# EAGLE design BaseModule_v8 (EAGLE 9.6.2)
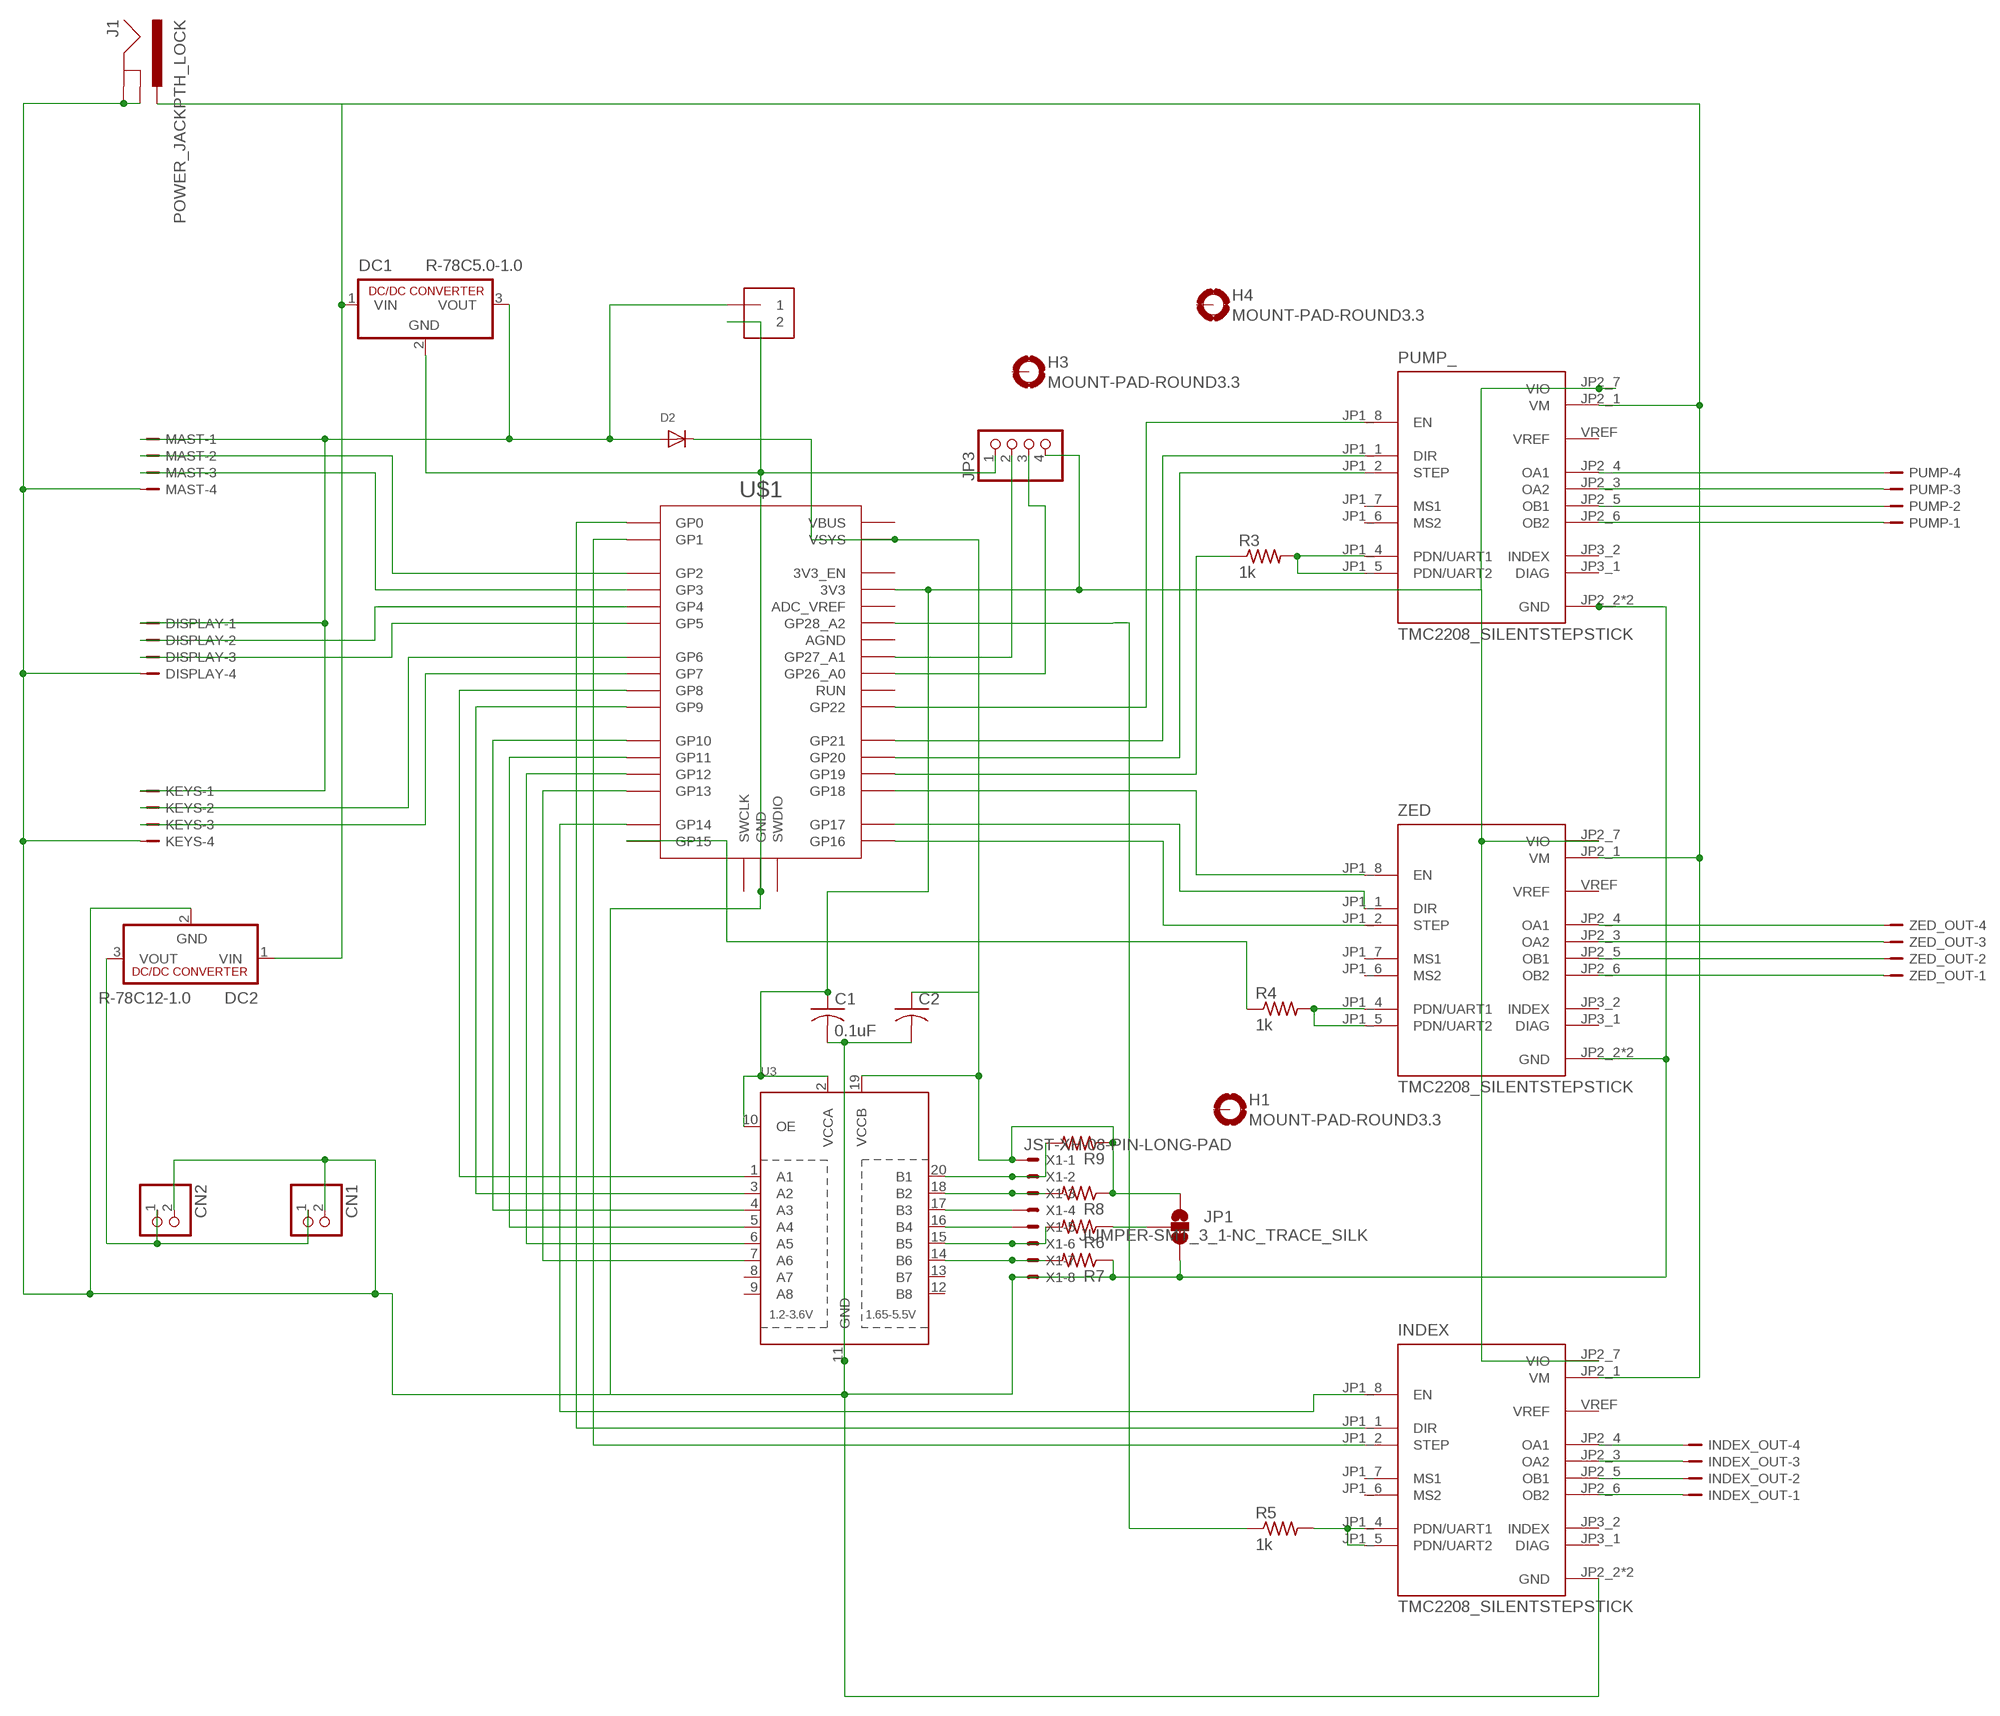
[diagram p0: schematic, sheet 1]

## Parts
C1  0.1uF  C-USC1206  [C1206]
C2  C-USC1206  [C1206]
CN1  JST_2PIN-THM-RA  [JST-PH-2-THM-RA]
CN2  JST_2PIN-THM-RA  [JST-PH-2-THM-RA]
D2  DIODESMA  [SMADIODE]
DC1  R-78C5.0-1.0  [SIP3]
DC2  R-78C12-1.0  [SIP3]
DISPLAY  JST-PH-4_TH-V  [B4B-PH-K-S]
H1  MOUNT-PAD-ROUND3.3  [3,3-PAD]
H3  MOUNT-PAD-ROUND3.3  [3,3-PAD]
H4  MOUNT-PAD-ROUND3.3  [3,3-PAD]
INDEX  TMC2208_SILENTSTEPSTICK  [MODULE_TMC2208_SILENTSTEPSTICK]
INDEX_OUT  JST-PH-4_TH-RA  [S4B-PH-KL]
J1  POWER_JACKPTH_LOCK  [POWER_JACK_PTH_LOCK]
J2  1X2-3.5MM  [1X2-3.5MM]
JP1  JUMPER-SMT_3_1-NC_TRACE_SILK  [SMT-JUMPER_3_1-NC_TRACE_SILK]
JP3  PINHD-1X4  [1X04]
KEYS  JST-PH-4_TH-V  [B4B-PH-K-S]
MAST  JST-PH-4_TH-V  [B4B-PH-K-S]
PUMP  JST-PH-4_TH-RA  [S4B-PH-KL]
PUMP_  TMC2208_SILENTSTEPSTICK  [MODULE_TMC2208_SILENTSTEPSTICK]
R3  1k  R-US_R1206  [R1206]
R4  1k  R-US_R1206  [R1206]
R5  1k  R-US_R1206  [R1206]
R6  R-US_M1206  [M1206]
R7  R-US_M1206  [M1206]
R8  R-US_M1206  [M1206]
R9  R-US_M1206  [M1206]
U3  TXB0108PWR  [TSSOP20]
U$1  RPI_PICO-TH  [RPI_PICO_TH]
X1  JST-XH-08-PIN-LONG-PAD  [JST-XH-08-PACKAGE-LONG-PAD]
ZED  TMC2208_SILENTSTEPSTICK  [MODULE_TMC2208_SILENTSTEPSTICK]
ZED_OUT  JST-PH-4_TH-RA  [S4B-PH-KL]

## Nets
5V: C2.1 D2.C JP1.1 R8.1 R9.1 U3.19(VCCB) U$1.VSYS X1.1
GND: C1.2 C2.2 CN1.2 CN2.2 DC1.2(GND) DC2.2(GND) DISPLAY.4 INDEX.JP2_2(GND) INDEX.JP2_8(GND) J1.GND J1.GNDBREAK J2.2 JP1.3 JP3.1 KEYS.4 MAST.4 PUMP_.JP2_2(GND) PUMP_.JP2_8(GND) R7.1 U3.11(GND) U$1.GND@1(GND) U$1.GND@2(GND) U$1.GND@3(GND) U$1.GND@4(GND) U$1.GND@5(GND) U$1.GND@6(GND) U$1.GND@7(GND) U$1.GND@8(GND) X1.8 ZED.JP2_2(GND) ZED.JP2_8(GND)
KEYS: KEYS.2 U$1.GP6
N$1: JP3.2 U$1.GP27_A1
N$2: JP3.3 U$1.GP26_A0
N$3: PUMP_.JP1_4(PDN/UART1) PUMP_.JP1_5(PDN/UART2) R3.2
N$4: R4.2 ZED.JP1_4(PDN/UART1) ZED.JP1_5(PDN/UART2)
N$5: DC1.1(VIN) DC2.1(VIN) INDEX.JP2_1(VM) J1.PWR PUMP_.JP2_1(VM) ZED.JP2_1(VM)
N$6: U$1.GP18 ZED.JP1_8(EN)
N$7: INDEX.JP2_4(OA1) INDEX_OUT.4
N$9: U3.7(A6) U$1.GP13
N$11: R9.2 U3.20(B1) X1.2
N$12: R4.1 U$1.GP15
N$13: D2.A DC1.3(VOUT) DISPLAY.1 J2.1 KEYS.1 MAST.1
N$14: INDEX.JP2_3(OA2) INDEX_OUT.3
N$15: ZED.JP2_4(OA1) ZED_OUT.4
N$16: ZED.JP2_3(OA2) ZED_OUT.3
N$17: ZED.JP2_5(OB1) ZED_OUT.2
N$18: ZED.JP2_6(OB2) ZED_OUT.1
N$19: PUMP.4 PUMP_.JP2_4(OA1)
N$20: PUMP.3 PUMP_.JP2_3(OA2)
N$21: PUMP.2 PUMP_.JP2_5(OB1)
N$22: PUMP.1 PUMP_.JP2_6(OB2)
N$23: U$1.GP17 ZED.JP1_1(DIR)
N$24: U$1.GP16 ZED.JP1_2(STEP)
N$25: R8.2 U3.18(B2) X1.3
N$26: PUMP_.JP1_8(EN) U$1.GP22
N$27: PUMP_.JP1_1(DIR) U$1.GP21
N$28: PUMP_.JP1_2(STEP) U$1.GP20
N$29: R3.1 U$1.GP19
N$30: MAST.2 U$1.GP2
N$31: MAST.3 U$1.GP3
N$32: DISPLAY.2 U$1.GP4
N$33: DISPLAY.3 U$1.GP5
N$35: KEYS.3 U$1.GP7
N$37: U3.17(B3) X1.4
N$38: U3.16(B4) X1.5
N$39: R6.2 U3.15(B5) X1.6
N$40: R7.2 U3.14(B6) X1.7
N$41: U3.1(A1) U$1.GP8
N$42: INDEX.JP2_5(OB1) INDEX_OUT.2
N$43: C1.1 INDEX.JP2_7(VIO) JP3.4 PUMP_.JP2_7(VIO) U3.2(VCCA) U3.10(OE) U$1.3V3 ZED.JP2_7(VIO)
N$46: U3.3(A2) U$1.GP9
N$47: U3.4(A3) U$1.GP10
N$48: U3.5(A4) U$1.GP11
N$49: U3.6(A5) U$1.GP12
N$50: CN1.1 CN2.1 DC2.3(VOUT)
N$53: INDEX.JP2_6(OB2) INDEX_OUT.1
N$54: INDEX.JP1_8(EN) U$1.GP14
N$55: R5.1 U$1.GP28_A2
N$56: INDEX.JP1_4(PDN/UART1) INDEX.JP1_5(PDN/UART2) R5.2
N$57: INDEX.JP1_1(DIR) U$1.GP0
N$58: INDEX.JP1_2(STEP) U$1.GP1
N$61: JP1.2 R6.1
Unconnected: H1.B3,3(MOUNT) H3.B3,3(MOUNT) H4.B3,3(MOUNT) INDEX.JP1_6(MS2) INDEX.JP1_7(MS1) INDEX.JP3_1(DIAG) INDEX.JP3_2(INDEX) INDEX.VREF PUMP_.JP1_6(MS2) PUMP_.JP1_7(MS1) PUMP_.JP3_1(DIAG) PUMP_.JP3_2(INDEX) PUMP_.VREF U3.8(A7) U3.9(A8) U3.12(B8) U3.13(B7) U$1.3V3_EN U$1.ADC_VREF U$1.AGND U$1.RUN U$1.SWCLK U$1.SWDIO U$1.VBUS ZED.JP1_6(MS2) ZED.JP1_7(MS1) ZED.JP3_1(DIAG) ZED.JP3_2(INDEX) ZED.VREF

## Library data of the parts
C1 C2 = adafruit:C-US: CAPACITOR, American symbol
CN1 CN2 = adafruit:JST_2PIN: JST 2-Pin Connectors of various flavors SMT-RA (S2B-PH-SM4) 4UConnector #17311 SMT (B2B-PH-SM4) THM-RA (S2B-PH) THM (B2B-PH)
D2 = adafruit:DIODE: Diode SMADIODE - SMA Surface Mount Package 20V 1A Schottky Diode Digikey: 641-1014-6-ND DO-1N4148 - Through Hole Small Current Diode SOD-123 20V 1 A (.5mV Vf) Schottky Diode - Digikey: MBRX120TPMSCT-ND SOD-323 10V 570mA (.38mV Vf, 3ns) Schottky Diode - Digikey: ZLLS410CT-ND SOD-523 30V 30mA Schottky Diode (RB751S-40TE61) - Digikey: RB751S-40TE61CT-ND SOT23-R/W - SOT23 Package (R = Solder Paste/Reflow Ovens, W = Hand-Soldering) BAT54Film 40V 300mA - Digikey: 497-7162-1-ND
DC1 DC2 = dc-dc-converter:R-78C*-1.0: INNOLINE DC/DC-Converter 1.0 AMP SIP3 Single Output Source: Data sheet <http://www.mikrocontroller.net/attachment/150645/157764-da-01-en-DC_DC_WANDLER_R_78C5_0_1_0.pdf>
DISPLAY KEYS MAST = con-JST-PH:JST-PH-4; MF: JST; MPN: B4B-PH-K-S
H1 H3 H4 = holes:MOUNT-PAD-ROUND: MOUNTING PAD, round
INDEX PUMP_ ZED = TMC2208_SILENTSTEPSTICK:TMC2208_SILENTSTEPSTICK: Check availability <https://pricing.snapeda.com/parts/TMC2208%20SILENTSTEPSTICK/Trinamic%20Motion/view-part?ref=eda>; AVAILABILITY: In Stock; CHECK_PRICES: https://www.snapeda.com/parts/TMC2208%20SILENTSTEPSTICK/Trinamic/view-part/?ref=eda; DESCRIPTION: TMC2208 Motor Controller/Driver, Stepper Power Management Evaluation Board; MF: Trinamic Motion; MP: TMC2208 SILENTSTEPSTICK; PACKAGE: None; PRICE: None; SNAPEDA_LINK: https://www.snapeda.com/parts/TMC2208%20SILENTSTEPSTICK/Trinamic/view-part/?ref=snap
INDEX_OUT PUMP ZED_OUT = con-JST-PH:JST-PH-4; MF: JST; MPN: S4B-PH-KL
J1 = SparkFun-Connectors:POWER_JACK: Power Jack Connector This is the standard 5.5mm barrel jack for power. The PTH is the most common, proven, reliable, footprint. The Slot footprint only works if the mill layer is transmitted to the PCB fab house so be warned. Here are the connectors we sell at SparkFun: DC Barrel Power Jack/Connector <https://www.sparkfun.com/products/119> (PRT-00119) DC Barrel Power Jack/Connector (SMD) <https://www.sparkfun.com/products/12748> (PRT-12748) DC Barrel Jack Adapter - Breadboard Compatible <https://www.sparkfun.com/products/10811> (PRT-10811) It is used on this SparkFun product (and many, many others): SparkFun RedBoard - Programmed with Arduino <https://www.sparkfun.com/products/12757> (DEV-12757) Also, if you need a mating power supply or connector, please check these out: Wall Adapter Power Supply - 9VDC 650mA <https://www.sparkfun.com/products/298> (TOL-00298) DC Barrel Jack Adapter - Male <https://www.sparkfun.com/products/10287> (PRT-10287); PROD_ID: CONN-08197; SF_ID: PRT-00119
J2 = adafruit:1X2: 3.5mm Terminal block http://www.ladyada.net/library/pcb/eaglelibrary.html
JP1 = SparkFun-Jumpers:JUMPER-SMT_3_1-NC_TRACE: Normally closed trace jumper (1 of 2 connections) This jumper has a trace between two pads so it's normally closed (NC). The other connection is normally open (NO). Use a razor knife to open the connection. For best results follow the IPC guidelines for cutting traces: Cutout at least 0.063 mm (0.005 in). Remove all loose material to clean up the cut area. Seal the cut with an approved epoxy. Reapply solder to reclose the connection, or to close the NO connection.
JP3 = pinhead:PINHD-1X4: PIN HEADER
R3-R9 = adafruit:R-US_: RESISTOR, American symbol
U3 = adafruit:TXB0108PWR: 8-Bit Bi-Directional Level Shifter 1.2V-3.6V (VCCA) to 1.65V-5.5V (VCCB) bi-directional level shifter with auto direction sensing. Max data rate - VCCA 1.8V: 20Mbps (50ns), VCCA 3.3V: 100Mbps (10ns) Digikey: 296-21527-1-ND
U$1 = RaspberryPi_Pico:RPI_PICO
X1 = Rembrandt Electronics - JST XH Connectors v1-0:JST-XH-08-PIN: JST XH Connector 2 Pin Wire to board connector. Pitch: 2,54 mm, (0.100") Number of pins: 8 Created by Rembrandt Electronics www.rembrandtelectronics.com

## Board
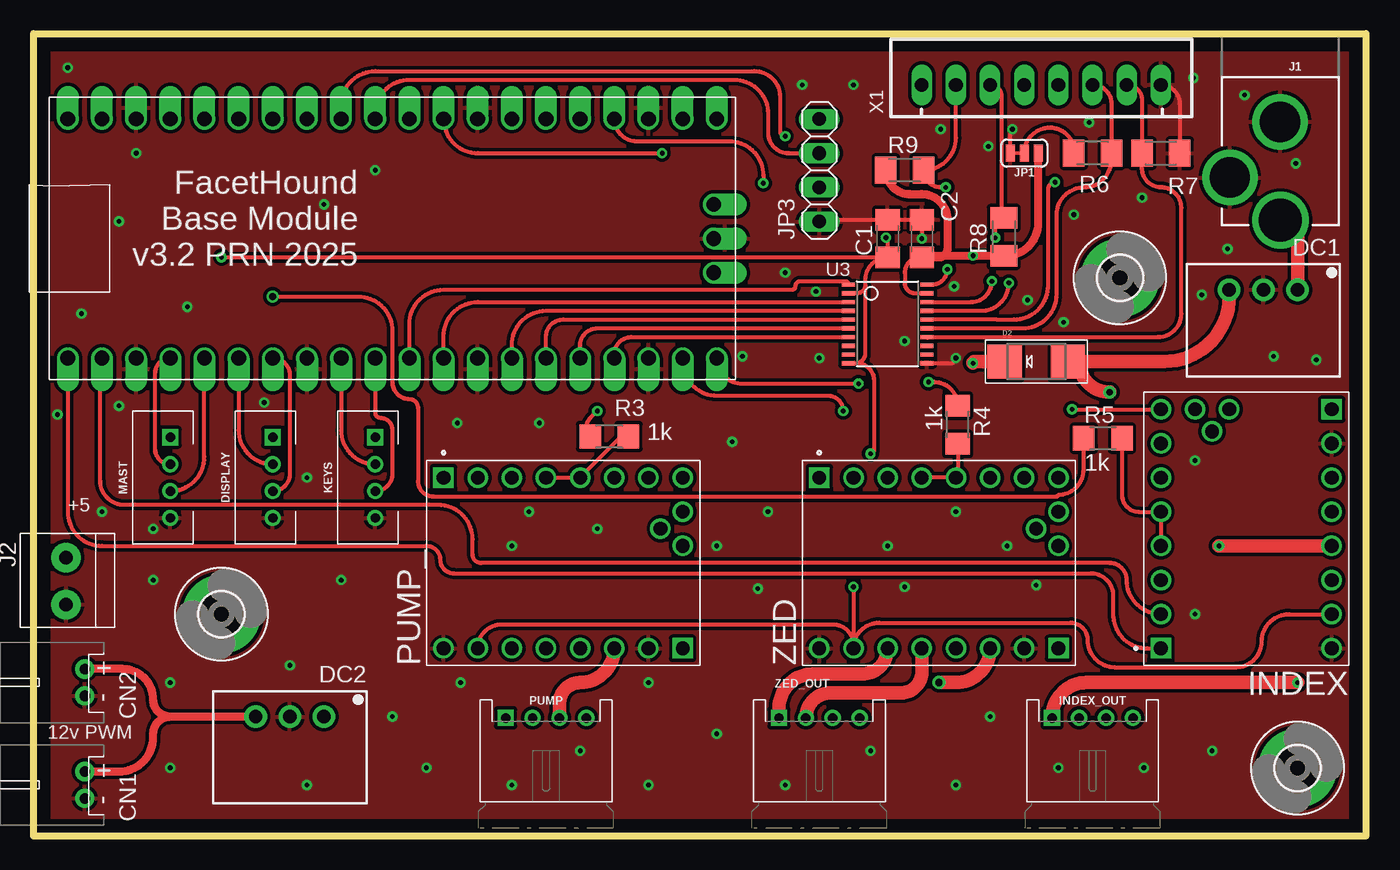
[diagram p1: board, top side]
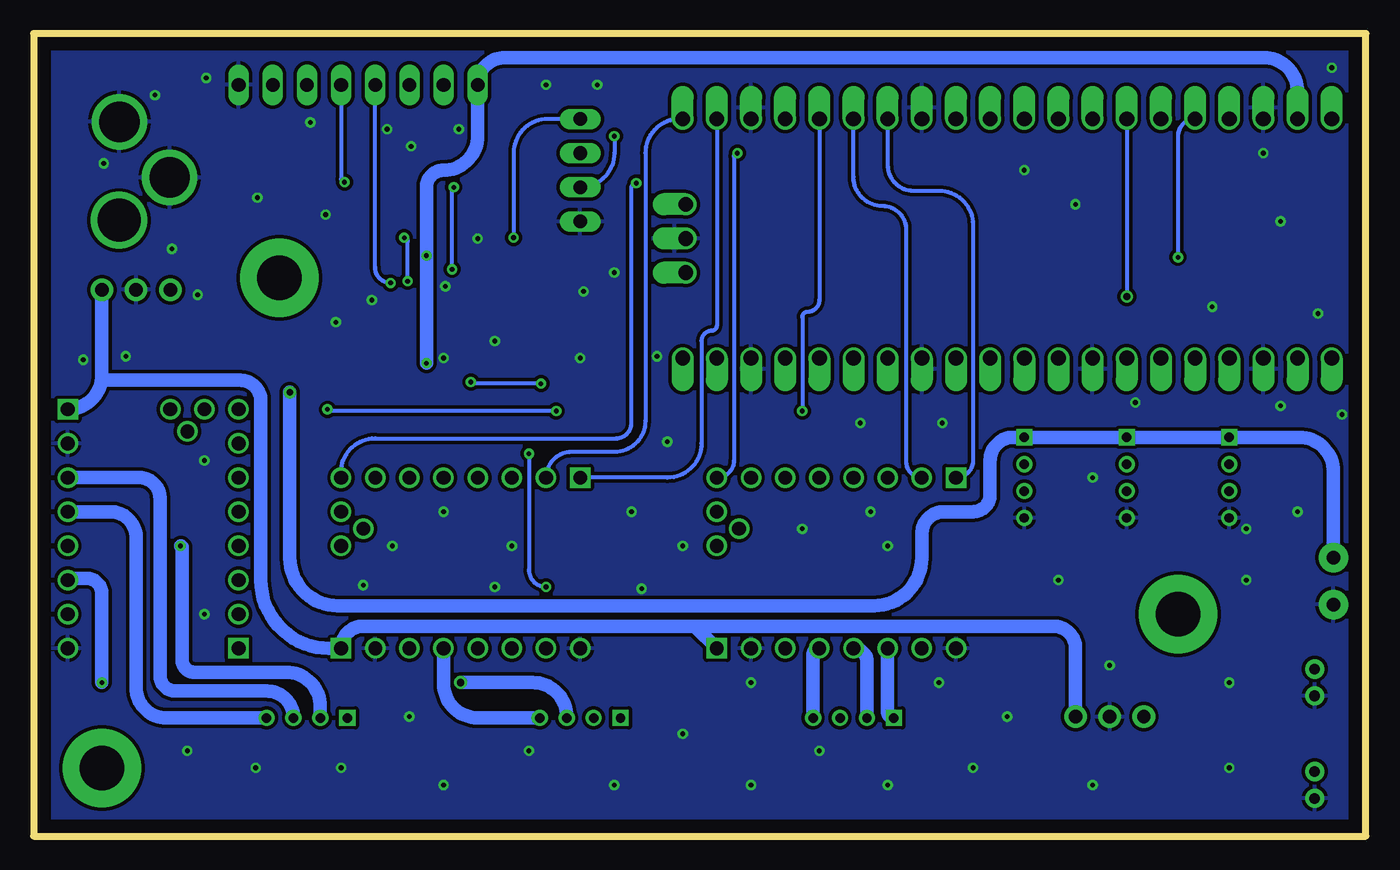
[diagram p2: board, bottom side, seen from below]

Size 99.06 x 59.69 mm. Coordinates in mm from the lower left corner, seen from the top.
Outline: 0,0 0,59.69 99.06,59.69 99.06,0 0,0
Copper layers (1*16): Top 0.035mm / dielectric 1.5mm / Bottom 0.035mm
Design rules "default": minimum track width 6mil, minimum drill 0.35mm, track to track 6mil, track to pad 6mil, pad to pad 6mil, via to via 6mil, smd to smd 6mil, copper to edge 40mil, drill to drill 6mil, minimum pad ring 10mil, minimum via ring 8mil, stop-mask expansion 4mil, vias tented up to drill 0mil, thermal gap 10mil

### Footprints (pad centres in the part's own frame; a part is rotated, then mirrored left to right if it is on the bottom)
C1206 = smd 1.6 x 1.8: 1 -1.4,0; 2 1.4,0
JST-PH-2-THM-RA = drill 0.8 pad 1.422: 1 1,0; 2 -1,0
SMADIODE = smd 2.54 x 2.54: A 2.349,0; C -2.349,0
SIP3 = drill 1 pad 1.676: 1 -2.54,0; 2 0,0; 3 2.54,0
B4B-PH-K-S = drill 0.7 square: 1 3,0 | drill 0.7: 2 1,0; 3 -1,0; 4 -3,0
3,3-PAD = drill 3.3 pad 5.842: B3,3 0,0
MODULE_TMC2208_SILENTSTEPSTICK = drill 1.016 square: JP1_1 6.35,8.89; JP2_1 -6.35,-8.89 | drill 1.016: JP1_2 6.35,6.35; JP1_3 6.35,3.81; JP1_4 6.35,1.27; JP1_5 6.35,-1.27; JP1_6 6.35,-3.81; JP1_7 6.35,-6.35; JP1_8 6.35,-8.89; JP2_2 -6.35,-6.35; JP2_3 -6.35,-3.81; JP2_4 -6.35,-1.27; JP2_5 -6.35,1.27; JP2_6 -6.35,3.81; JP2_7 -6.35,6.35; JP2_8 -6.35,8.89; JP3_1 1.27,-8.89; JP3_2 3.81,-8.89; VREF 2.54,-7.239
S4B-PH-KL = drill 0.7 square: 1 3,-3.72 | drill 0.7: 2 1,-3.72; 3 -1,-3.72; 4 -3,-3.72
POWER_JACK_PTH_LOCK = drill 2.997 pad 4.115: GND 0.025,6.557; GNDBREAK 3.762,10.7 | drill 3.2 pad 4.115: PWR 0,13.878
1X2-3.5MM = drill 1 pad 2.184: 1 1.8,0; 2 -1.7,0
SMT-JUMPER_3_1-NC_TRACE_SILK = smd 0.66 x 1.27: 1 -1.041,0; 2 0,0; 3 1.041,0
1X04 = drill 1.016 long: 1 -3.81,0; 2 -1.27,0; 3 1.27,0; 4 3.81,0
R1206 = smd 1.6 x 1.803: 1 -1.422,0; 2 1.422,0
M1206 = smd 1.6 x 2: 1 -1.4,0; 2 1.4,0
TSSOP20 = smd 0.305 x 0.991: 1 -2.925,-2.918; 2 -2.275,-2.918; 3 -1.625,-2.918; 4 -0.975,-2.918; 5 -0.325,-2.918; 6 0.325,-2.918; 7 0.975,-2.918; 8 1.625,-2.918; 9 2.275,-2.918; 10 2.925,-2.918; 11 2.925,2.918; 12 2.275,2.918; 13 1.625,2.918; 14 0.975,2.918; 15 0.325,2.918; 16 -0.325,2.918; 17 -0.975,2.918; 18 -1.625,2.918; 19 -2.275,2.918; 20 -2.925,2.918
RPI_PICO_TH = drill 1.1 pad 1.6 offset: 3V3 8.89,13.97; 3V3_EN 8.89,16.51; ADC_VREF 8.89,11.43; AGND 8.89,6.35; GND@1 -8.89,19.05; GND@2 -8.89,6.35; GND@3 -8.89,-6.35; GND@4 -8.89,-19.05; GND@5 0,-23.9; GND@6 8.89,-19.05; GND@7 8.89,-6.35; GND@8 8.89,19.05; GP0 -8.89,24.13; GP1 -8.89,21.59; GP2 -8.89,16.51; GP3 -8.89,13.97; GP4 -8.89,11.43; GP5 -8.89,8.89; GP6 -8.89,3.81; GP7 -8.89,1.27; GP8 -8.89,-1.27; GP9 -8.89,-3.81; GP10 -8.89,-8.89; GP11 -8.89,-11.43; GP12 -8.89,-13.97; GP13 -8.89,-16.51; GP14 -8.89,-21.59; GP15 -8.89,-24.13; GP16 8.89,-24.13; GP17 8.89,-21.59; GP18 8.89,-16.51; GP19 8.89,-13.97; GP20 8.89,-11.43; GP21 8.89,-8.89; GP22 8.89,-3.81; GP26_A0 8.89,1.27; GP27_A1 8.89,3.81; GP28_A2 8.89,8.89; RUN 8.89,-1.27; SWCLK -2.54,-23.9; SWDIO 2.54,-23.9; VBUS 8.89,24.13; VSYS 8.89,21.59
JST-XH-08-PACKAGE-LONG-PAD = drill 1.016 long: 1 -8.89,0; 2 -6.35,0; 3 -3.81,0; 4 -1.27,0; 5 1.27,0; 6 3.81,0; 7 6.35,0; 8 8.89,0

### Placement (x,y rotation side)
C1  63.5,44.45 90 top
C2  66.04,44.45 90 top
CN1  3.81,3.81 90 top
CN2  3.81,11.43 90 top
D2  74.55,35.31 0 top
DC1  91.44,40.64 180 top
DC2  19.05,8.89 180 top
DISPLAY  17.78,26.67 90 top
H1  80.77,41.53 0 top
H3  93.98,5.08 0 top
H4  13.97,16.51 0 top
INDEX  90.17,22.86 180 top
INDEX_OUT  78.74,5.08 180 top
J1  92.71,59.69 180 top
J2  2.41,18.92 90 top
JP1  73.66,50.8 180 top
JP3  58.42,49.53 90 top
KEYS  25.4,26.67 90 top
MAST  10.16,26.67 90 top
PUMP  38.1,5.08 180 top
PUMP_  39.37,20.32 90 top
R3  42.8,29.72 0 top
R4  68.71,30.61 270 top
R5  79.5,29.59 0 top
R6  78.74,50.8 0 top
R7  83.82,50.8 180 top
R8  72.14,44.58 90 top
R9  64.77,49.53 0 top
U3  63.5,38.1 270 top
U$1  26.67,44.45 90 top
X1  74.93,55.88 0 top
ZED  67.31,20.32 90 top
ZED_OUT  58.42,5.08 180 top

### Tracks (layer width: path | path; a pad name or v marks a point on that pad's centre or on a via)
5V  (via drill 0.35)
  Top 0.305: R8.1 72.14,43.31 | C2.1 65.91,43.05 arc90 64.77,41.91 64.77,41.15 arc90 65.53,40.39 66.41,40.39 arc-90 U3.19
  Top 0.61: R9.1 arc90 65.15,47.75 66.04,47.75 arc-90 67.94,45.85 67.94,43.69 arc-90 67.31,43.05 C2.1 arc-90 66.17,43.18 v69.85,43.18 R8.1 arc-90 R8.1 72.29,43.18 arc90 74.7,45.59 JP1.1
  Top 1.016: v69.85,35.18 arc-90 69.98,35.31 D2.C
  Bottom 1.016: v69.85,35.18 v69.85,43.18 69.85,48.26 arc90 68.58,49.53 arc-90 66.04,52.07 X1.1 arc90 64.01,57.91 7.62,57.91 arc90 5.08,55.37 U$1.VSYS 5.08,54.61
GND  (via drill 0.35)
  Top 0.305: U3.11 68.19,35.17 arc90 v68.58,35.56 | JP3.1 arc-90 58.55,45.85 C1.2 C2.2 v66.04,44.45 | X1.8 arc-90 85.22,54.48 R7.1 | JP1.3 72.62,52.43 arc-90 v72.77,52.58
  other vias: 8.89,19.05 10.16,11.43 10.16,5.08 19.05,12.7 22.86,19.05 26.67,8.89 29.21,5.08 31.75,11.43 20.32,3.81 45.72,3.81 40.64,6.35 35.56,3.81 45.72,11.43 50.8,7.62 55.88,3.81 62.23,6.35 68.58,3.81 71.12,8.89 76.2,5.08 82.55,5.08 87.63,6.35 86.36,16.51 86.36,27.94 72.39,21.59 68.58,24.13 63.5,21.59 54.61,24.13 50.8,21.59 41.91,22.86 36.83,24.13 35.56,21.59 20.32,26.67 8.89,22.86 5.08,24.13 11.43,39.37 6.35,45.72 25.4,49.53 21.59,46.99 7.62,50.8 2.54,57.15 57.15,55.88 60.96,55.88 64.77,36.83 58.42,35.56 55.88,41.91 52.7,35.69 77.34,46.23 82.42,47.5 88.77,43.69 93.85,50.04 90.04,55.12 86.23,56.39 70.99,51.31 67.44,52.58 78.49,53.09 76.58,38.23 73.91,39.88 68.45,40.89 51.94,29.34 37.59,30.73 31.5,30.73 92.2,35.69 95.38,35.43 86.87,40.26 64.77,18.54 74.55,18.67 53.85,18.41 1.78,31.37 6.35,32 17.14,32.26 3.56,38.86 58.17,40.51
  pour Bottom (isolate 0.254): 0,59.69 0,1.27 99.06,1.27 99.06,59.69
  pour Top (isolate 0.254): 0,0 99.06,0 99.06,58.42 0,58.42
KEYS
  Top 0.305: U$1.GP6 22.86,30.21 arc90 KEYS.2
N$1  (via drill 0.35)
  Top 0.305: U$1.GP27_A1 22.86,54.36 arc-90 25.4,56.9 53.59,56.9 arc-90 55.5,54.99 55.5,52.45 arc90 v55.88,52.07
  Bottom 0.305: v55.88,52.07 55.88,50.8 arc90 JP3.2
N$2
  Top 0.305: U$1.GP26_A0 25.4,53.72 arc-90 27.94,56.26 52.07,56.26 arc-90 54.61,53.72 54.61,52.32 arc90 56.13,50.8 JP3.3
N$3
  Top 0.305: R3.2 43.69,29.72 PUMP_.JP1_5 PUMP_.JP1_4
N$4
  Top 0.305: 68.58,29.87 arc90 68.71,29.74 R4.2 68.71,26.8 arc-90 ZED.JP1_5 ZED.JP1_4
N$5
  Top 1.016: DC1.1 93.98,44.54 arc90 J1.PWR 93.34,45.81
  Bottom 1.016: DC1.1 93.98,34.29 | 93.98,34.29 93.98,33.91 83.69,33.91 arc90 82.17,32.38 82.17,19.05 arc-90 77.09,13.97 ZED.JP2_1 arc90 74.55,15.62 49.91,15.62 | PUMP_.JP2_1 49.91,15.62 | 93.98,34.29 arc90 INDEX.JP2_1 | 49.91,15.62 23.24,15.62 arc90 21.59,13.97 DC2.1
N$6  (via drill 0.35)
  Top 0.305: 43.05,53.47 arc90 U$1.GP18 arc90 44.83,51.69 51.71,51.69 arc-90 54.25,49.15 v54.25,48.57
  Bottom 0.305: ZED.JP1_8 76.2,27.05 arc90 73.66,29.59 55.75,29.59 arc-90 54.61,30.73 54.61,48.21 arc90 v54.25,48.57
N$7
  Bottom 1.016: INDEX_OUT.4 89.19,8.8 arc90 91.44,11.05 91.44,22.23 arc-90 93.34,24.13 INDEX.JP2_4
N$9
  Top 0.305: U$1.GP13 43.18,35.85 arc-90 44.45,37.12 U3.7
N$11  (via drill 0.35)
  Top 0.305: X1.2 68.58,51.94 arc-90 R9.2 arc90 67.44,48.26 v67.82,48.26 | U3.20 66.81,41.02 arc90 v67.94,42.16
  Bottom 0.305: v67.94,42.16 67.94,48.13 arc90 v67.82,48.26
N$12  (via drill 0.35)
  Top 0.305: U$1.GP15 arc90 52.7,33.66 v61.34,33.66 | v66.55,33.78 66.95,33.78 arc-90 R4.1
  Bottom 0.305: v61.34,33.66 66.42,33.66 arc90 v66.55,33.78
N$13  (via drill 0.5)
  Top 1.016: DC1.3 88.9,40.13 arc-90 84.07,35.31 D2.A 77.72,35.31 arc90 v80.01,33.02
  Bottom 1.016: v80.01,33.02 80.01,20.7 arc-90 76.45,17.14 36.58,17.14 arc-90 33.02,20.7 33.02,22.48 arc90 31.37,24.13 29.21,24.13 arc-90 27.94,25.4 27.94,27.94 arc90 26.21,29.67 KEYS.1 DISPLAY.1 MAST.1 4.95,29.67 arc90 2.41,27.13 J2.1
N$14
  Bottom 1.016: INDEX_OUT.3 arc-90 81.73,10.79 88.52,10.79 arc90 89.66,11.94 89.66,25.15 arc-90 91.19,26.67 INDEX.JP2_3
N$15
  Bottom 1.016: ZED_OUT.4 66.04,8.8 arc90 68.58,11.34 ZED.JP2_4
N$16  (via drill 0.55)
  Top 1.016: v67.31,11.43 68.58,11.43 arc90 ZED.JP2_3
  Bottom 1.016: ZED_OUT.3 59.42,8.89 arc-90 61.96,11.43 v67.31,11.43
N$17
  Top 1.016: ZED_OUT.2 arc-90 59.29,10.67 64.52,10.67 arc90 66.04,12.19 ZED.JP2_5
N$18
  Top 1.016: ZED_OUT.1 55.42,9.53 arc-90 57.96,12.06 61.59,12.06 arc90 ZED.JP2_6
N$19
  Bottom 1.016: PUMP_.JP2_4 arc-90 41.1,13.51 PUMP.4
N$20
  Top 1.016: PUMP.3 39.1,9.89 arc-90 40.64,11.43 arc90 PUMP_.JP2_3
N$21
  Bottom 1.016: PUMP_.JP2_5 arc90 37.08,12.95 37.08,8.82 arc90 PUMP.2
N$22
  Bottom 1.016: PUMP_.JP2_6 35.56,9.26 arc-90 PUMP.1
N$23
  Bottom 0.305: U$1.GP17 48.26,37.97 arc90 48.64,37.59 arc-90 49.4,36.83 49.4,29.21 arc90 51.94,26.67 ZED.JP1_1
N$24
  Bottom 0.305: U$1.GP16 51.03,53.34 arc-90 53.57,50.8 53.57,30.88 arc90 55.88,28.57 59.05,28.57 arc-90 ZED.JP1_2
N$25  (via drill 0.35)
  Top 0.305: X1.3 arc-90 71.97,55.03 71.97,45.98 R8.2 arc90 71.5,45.34 v71.5,44.51 | U3.18 69.7,39.73 arc90 v71.25,41.27
  Bottom 0.305: v71.25,41.27 71.25,44.25 arc-90 v71.5,44.51
N$26  (via drill 0.35)
  Top 0.305: U$1.GP22 arc90 33.02,50.8 v46.74,50.8
  Bottom 0.305: v46.74,50.8 arc-90 46.99,50.55 46.99,27.94 arc90 PUMP_.JP1_8
N$27
  Bottom 0.305: U$1.GP21 35.56,49.91 arc-90 33.66,48.01 31.75,48.01 arc90 29.21,45.47 29.21,27.94 arc90 PUMP_.JP1_1
N$28
  Bottom 0.305: PUMP_.JP1_2 arc90 34.16,27.81 34.16,45.09 arc-90 35.94,46.86 arc90 38.1,49.02 U$1.GP20 38.1,54.61
N$29  (via drill 0.35)
  Top 0.305: v41.91,31.62 41.38,31.09 arc90 R3.1
  Bottom 0.305: U$1.GP19 40.64,39.88 arc90 41.53,38.99 arc-90 41.91,38.61 v41.91,31.62
N$30
  Top 0.305: U$1.GP2 arc90 9.02,34.42 9.02,28.81 arc90 MAST.2
N$31
  Top 0.305: MAST.3 arc90 12.7,28.21 U$1.GP3
N$32
  Top 0.305: U$1.GP4 15.24,30.21 arc90 DISPLAY.2
N$33
  Top 0.305: U$1.GP5 arc-90 19.05,34.29 19.05,26.94 arc-90 DISPLAY.3
N$35
  Top 0.305: U$1.GP7 25.4,31.5 arc90 25.78,31.11 arc-90 26.67,30.23 26.67,26.94 arc-90 KEYS.3
N$37  (via drill 0.35)
  Top 0.305: U3.17 70.44,39.08 arc90 v72.52,41.15
  Bottom 0.305: v72.52,41.15 arc90 73.66,42.29 X1.4
N$38  (via drill 0.35)
  Top 0.305: U3.16 71.12,38.42 71.57,38.42 72.9,38.42 arc90 75.44,40.97 75.44,48.13 arc-90 v75.95,48.64
  Bottom 0.305: X1.5 76.2,48.9 arc-90 v75.95,48.64
N$39
  Top 0.305: X1.6 arc-90 80.14,54.48 R6.2 | 80.14,49.91 R6.2 | R6.2 80.14,50.3 arc-90 78.11,48.26 arc90 76.07,46.23 76.07,40.31 arc-90 73.53,37.77 U3.15
N$40
  Top 0.305: 66.46,37.08 arc-90 U3.14 83.61,37.12 arc90 85.34,38.86 85.34,46.74 arc90 83.82,48.26 arc-90 82.42,49.66 R7.2 82.42,54.74 arc90 X1.7
N$41
  Top 0.305: U$1.GP8 27.94,38.1 arc-90 30.48,40.64 56.39,40.64 arc90 56.64,40.89 arc-90 57.02,41.27 60.33,41.27 arc-90 U3.1
N$42  (via drill 0.35)
  Top 1.016: v88.14,21.59 INDEX.JP2_5
  Bottom 1.016: INDEX_OUT.2 77.74,9.65 arc-90 80.28,12.19 87.12,12.19 arc90 88.01,13.08 88.01,21.46 arc-90 v88.14,21.59
N$43  (via drill 0.35)
  Top 0.305: 61.85,41.02 arc-90 61.21,40.39 60.59,40.39 arc90 U3.2 | C1.1 v13.97,43.05 arc-90 v13.97,43.05 | INDEX.JP2_7 93.34,16.51 arc90 91.31,14.48 arc-90 89.41,12.57 80.39,12.57 arc-90 78.36,14.61 arc90 77.09,15.88 62.87,15.88 arc90 ZED.JP2_7 60.96,14.22 | 61.85,41.02 61.85,35.94 arc-90 61.08,35.17 U3.10 61.22,35.17 arc-90 62.48,33.91 62.48,28.7 arc-90 v62.23,28.45 | 61.85,41.02 61.85,41.4 arc-90 C1.1 | v63.37,44.52 arc-90 63.5,44.39 C1.1 | v60.96,18.54 60.96,14.22 | PUMP_.JP2_7 arc-90 34.8,15.75 59.44,15.75 arc-90 60.96,14.22
  Bottom 0.305: U$1.3V3 arc-90 13.97,52.07 v13.97,43.05 | JP3.4 60.83,53.34 arc-90 63.37,50.8 v63.37,44.52 | v62.23,28.45 62.23,19.81 arc-90 v60.96,18.54
N$46
  Top 0.305: U$1.GP9 30.48,37.19 arc-90 33.02,39.73 U3.3
N$47
  Top 0.305: U$1.GP10 35.56,36.53 arc-90 38.1,39.08 U3.4
N$48
  Top 0.305: U$1.GP11 38.1,37.16 arc-90 39.37,38.42 U3.5
N$49
  Top 0.305: U$1.GP12 40.64,36.51 arc-90 41.91,37.77 U3.6
N$50
  Top 0.61: DC2.3 10.16,8.89 | 10.16,8.89 arc-90 8.89,10.16 arc90 6.62,12.43 CN2.1 | CN1.1 6.35,4.81 arc90 8.89,7.35 8.89,7.62 arc-90 10.16,8.89
N$53  (via drill 0.35)
  Top 1.016: INDEX_OUT.1 75.74,8.89 arc-90 78.28,11.43 v93.98,11.43
  Bottom 1.016: v93.98,11.43 93.98,18.03 arc-90 95.12,19.18 96.39,19.18 arc-90 INDEX.JP2_6
N$54  (via drill 0.35)
  Top 0.305: U$1.GP14 48.26,35.31 arc90 50.8,32.77 59.05,32.77 arc-90 v60.2,31.62 | v77.22,31.75 INDEX.JP1_8
  Bottom 0.305: v60.2,31.62 77.09,31.62 arc90 v77.22,31.75
N$55  (via drill 0.5)
  Top 0.305: 78.74,28.93 arc90 R5.1 78.08,27.28 arc-90 76.2,25.4 arc-90 76.07,25.27 29.72,25.27 arc-90 28.57,26.42 28.57,31.88 arc90 27.94,32.51 arc-90 26.67,33.78 26.67,37.59 arc90 24.13,40.13 v17.78,40.13
  Bottom 0.305: v17.78,40.13 U$1.GP28_A2 17.78,54.61
N$56
  Top 0.305: INDEX.JP1_4 INDEX.JP1_5 82.17,24.13 arc-90 80.92,25.38 R5.2
N$57
  Top 0.305: U$1.GP0 2.54,24.13 arc90 5.08,21.59 29.21,21.59 arc-90 30.23,20.57 arc90 31.24,19.56 78.61,19.56 arc-90 80.26,17.91 80.26,16.51 arc90 82.8,13.97 INDEX.JP1_1
N$58
  Top 0.305: U$1.GP1 arc90 4.95,35.43 4.95,26.42 arc90 6.73,24.64 30.1,24.64 arc-90 32.64,22.1 32.64,20.95 arc90 33.27,20.32 80.01,20.32 arc-90 81.28,19.05 arc90 INDEX.JP1_2
N$61
  Top 0.305: JP1.2 arc-90 75.56,52.7 arc-90 77.34,50.93 R6.1

### Text on the board
tPlace: FacetHound / Base Module / v3.2 PRN 2025
tNames: +5 | 12v PWM